# Altium schematic sheet Power_Supply.SchDoc
size A3; PageSetup: Record=PageOptions|CenterHorizontal=True|CenterVertical=True|PrintScale=0.73|XCorrection=1.00|YCorrection=1.00|PrintKind=0|BorderSize=5000000|LeftOffset=0|BottomOffset=0|Orientation=2|PaperLength=1000|PaperWidth=1000|Scale=100|PaperSource=7|PrintQuality=-4|MediaType=1|DitherType=10|PaperKind=A4|PrintScaleMode=1; Date: 27.05.2014; DrawnBy: luths8; Organization: BFH; Address1: Bern University of Applied Sciences; Address2: Engineering and Information Technology; Address3: Jlcoweg 1; Address4: CH-3400 Burgdorf; DocumentNumber: 3; Revision: 1.0; SheetNumber: 6; SheetTotal: 19; CurrentDate: 27.05.2014
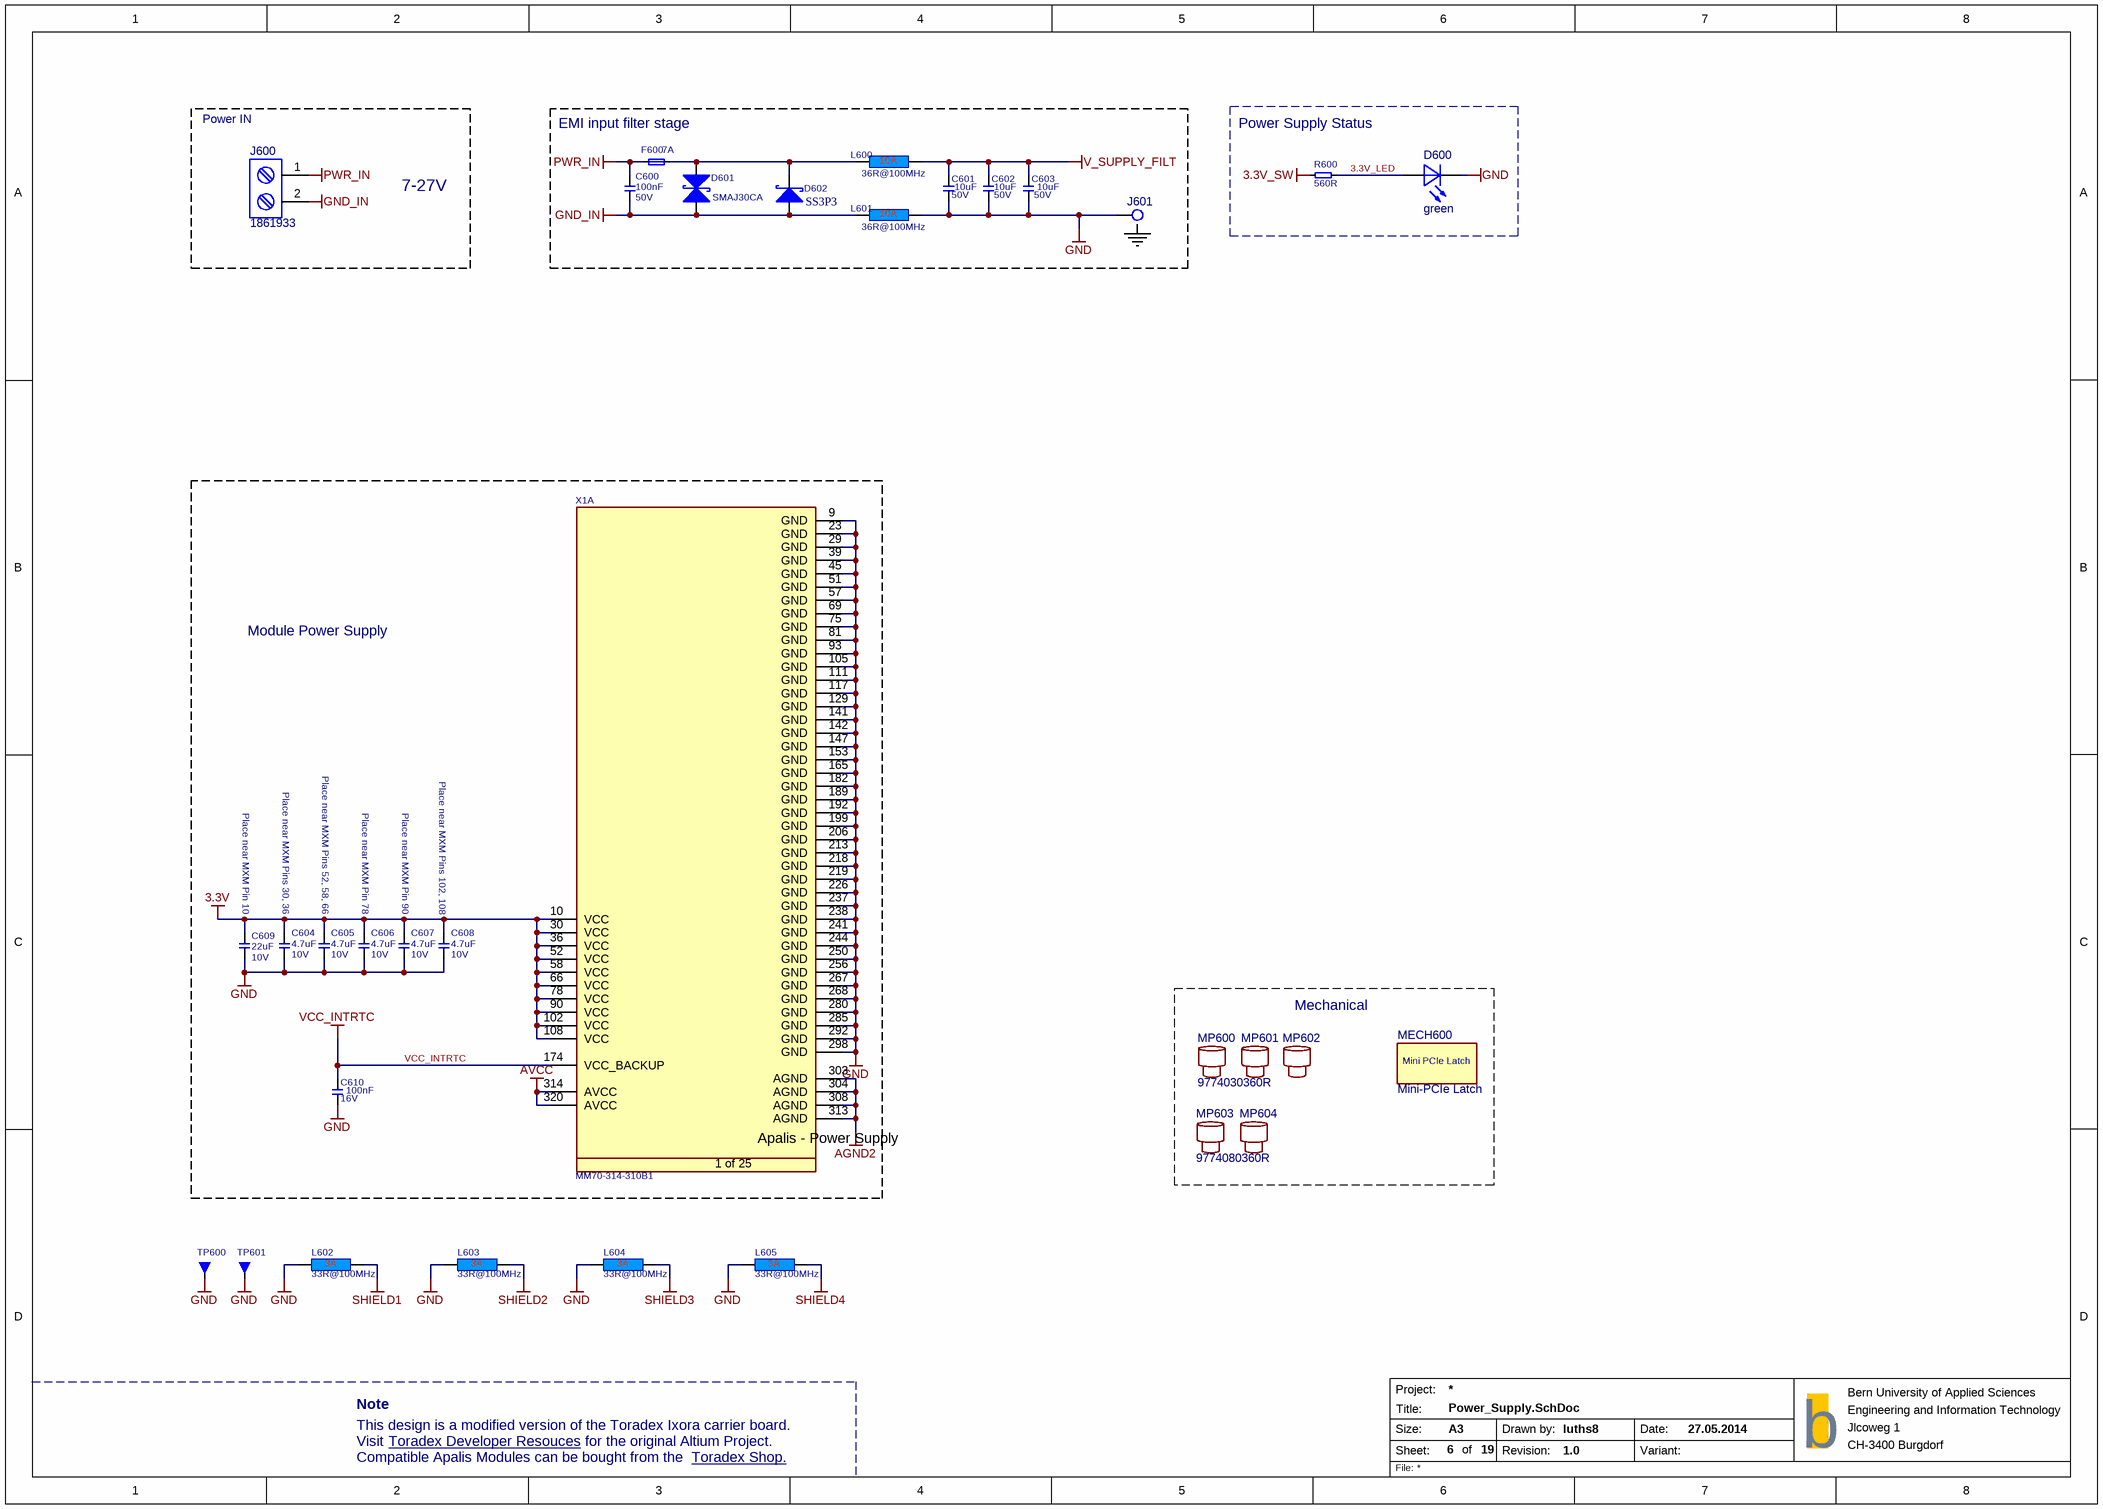
[diagram p0: Power_Supply.SchDoc]

## Parts
C600  Rating: 50V  [SMD0603CAP]  (hidden comment: 100nF)
C601  Rating: 50V  [SMD1210CAP]  (hidden comment: 10uF)
C602  Rating: 50V  [SMD1210CAP]  (hidden comment: 10uF)
C603  Rating: 50V  [SMD1210CAP]  (hidden comment: 10uF)
C604  Rating: 10V  [SMD0603CAP]  (hidden comment: 4.7uF)
C605  Rating: 10V  [SMD0603CAP]  (hidden comment: 4.7uF)
C606  Rating: 10V  [SMD0603CAP]  (hidden comment: 4.7uF)
C607  Rating: 10V  [SMD0603CAP]  (hidden comment: 4.7uF)
C608  Rating: 10V  [SMD0603CAP]  (hidden comment: 4.7uF)
C609  Rating: 10V  [SMD0805CAP]  (hidden comment: 22uF)
C610  Rating: 16V  [SMD0603CAP]  (hidden comment: 100nF)
D600  green  [LED]
D601  Manufacturer Part No.: SMAJ30CA  [T_LITTLEFUSE_SMAJ30CA]  (hidden comment: D-Littelfuse-SMAJ30CA-Schottky)
D602  SS3P3  [T_VISHAY_SS3P3]
F600  7A  [T_Littelfuse_0458]
J600  1861933  [1861933]
J601  Solder Pin  [SOLDER_PIN]  (value not drawn)  (net tie, no BOM)
L600  36R@100MHz  [T_Laird_35F0121-0SR-10]
L601  36R@100MHz  [T_Laird_35F0121-0SR-10]
L602  33R@100MHz  [INDC1608X95N]
L603  33R@100MHz  [INDC1608X95N]
L604  33R@100MHz  [INDC1608X95N]
L605  33R@100MHz  [INDC1608X95N]
MECH600  Mini-PCIe Latch  [T_Molex_48099-5701]
MP600  9774030360R
MP601  9774030360R  (value not drawn)
MP602  9774030360R  (value not drawn)
MP603  9774080360R
MP604  9774080360R  (value not drawn)
R600  560R  [SMD0603RES]
TP600  5011  [T_TP-THT - EYE]  (value not drawn)
TP601  5011  [T_TP-THT - EYE]  (value not drawn)
X1  Manufacturer Part No.: MM70-314-310B1  [T_JAE_MM70-314-310B1]  (hidden comment: CON-JAE-MM70-314-310B1-314-0.5mm)  (part A of 25)

## Blocks framed on the sheet
7-27V: J600
EMI input filter stage: C600-C603 D601 D602 F600 J601 L600 L601
Power Supply Status: D600 R600
Module Power Supply: C604-C610 X1
Mechanical: MECH600 MP600-MP604

## Nets
3.3V: C604.1 C605.1 C606.1 C607.1 C608.1 C609.1 X1.10(VCC) X1.30(VCC) X1.36(VCC) X1.52(VCC) X1.58(VCC) X1.66(VCC) X1.78(VCC) X1.90(VCC) X1.102(VCC) X1.108(VCC)
3.3V_SW: R600.1
AGND2: X1.303(AGND) X1.304(AGND) X1.308(AGND) X1.313(AGND)
AVCC: X1.314(AVCC) X1.320(AVCC)
GND: C601.1 C602.1 C603.1 C604.2 C605.2 C606.2 C607.2 C608.2 C609.2 C610.1 D600.C J601.1 L601.2 L602.1 L603.1 L604.1 L605.1 TP600.1 TP601.1 X1.9(GND) X1.23(GND) X1.29(GND) X1.39(GND) X1.45(GND) X1.51(GND) X1.57(GND) X1.69(GND) X1.75(GND) X1.81(GND) X1.93(GND) X1.105(GND) X1.111(GND) X1.117(GND) X1.129(GND) X1.141(GND) X1.142(GND) X1.147(GND) X1.153(GND) X1.165(GND) X1.182(GND) X1.189(GND) X1.192(GND) X1.199(GND) X1.206(GND) X1.213(GND) X1.218(GND) X1.219(GND) X1.226(GND) X1.237(GND) X1.238(GND) X1.241(GND) X1.244(GND) X1.250(GND) X1.256(GND) X1.267(GND) X1.268(GND) X1.280(GND) X1.285(GND) X1.292(GND) X1.298(GND)
GND_IN: C600.1 D601.2(Anode) D602.2 J600.2 L601.1
PWR_IN: C600.2 F600.1 J600.1
SHIELD1: L602.2
SHIELD2: L603.2
SHIELD3: L604.2
SHIELD4: L605.2
V_SUPPLY_FILT: C601.2 C602.2 C603.2 L600.2
VCC_INTRTC: C610.2 X1.174(VCC_BACKUP)
3.3V_LED: D600.A R600.2
NetD601_1: D601.1(Cathode) D602.1 F600.2 L600.1

## Notes on the sheet
- Power IN
- (near C604) Place near MXM Pins 30, 36
- (near C605) Place near MXM Pins 52, 58, 66
- Place near MXM Pins 102, 108
- Place near MXM Pin 10
- Place near MXM Pin 78
- Place near MXM Pin 90
- Note
- This design is a modified version of the Toradex Ixora carrier board.
- Visit
- Compatible Apalis Modules can be bought from the
- Toradex Developer Resouces <https://developer.toradex.com/products/ixora-carrier-board>
- for the original Altium Project.
- Toradex Shop. <https://www.toradex.com/order-now/apalis-arm-family>
- Project:
- Size:
- Sheet:
- Title:
- A3
- of
- Drawn by:
- Revision:
- Date:
- Variant:
- b
- File:
- (in symbol CON-JAE-MM70-314-310B1-314-0.5mm, part A) Apalis - Power Supply; 1 of 25
- (in symbol MECH-Molex-48099-5701) Mini PCIe Latch

## Library data of the parts
C600 = C-X7R-100nF-50V-20%-0603: Capacitor Ceramic X7R 100nF 50V 20% 0603; Tolerance: 20%; Type: X7R; Value: 100nF
C601-C603 = C-X5R-10uF-50V-20%-1210: Capacitor Ceramic X5R 10uF 50V 20% 1210; Tolerance: 20%; Type: X5R; Value: 10uF
C604-C608 = C-X5R-4.7uF-10V-10%-0603: Capacitor Ceramic X5R 4.7uF 10V 10% 0603; Tolerance: 10%; Type: X5R; Value: 4.7uF
C609 = C-X5R-22uF-10V-20%-0805: Capacitor Ceramic X5R 22uF 10V 20% 0805; Tolerance: 20%; Type: X5R; Value: 22uF
C610 = C-X7R-100nF-16V-10%-0402: Capacitor Ceramic X7R 100nF 16V 10% 0603; Tolerance: 10%; Type: X7R; Value: 100nF
D600 = LED green: Manufacturer Part No.: LGM67KG1J224Z
D601 = D-Littelfuse-SMAJ30CA-Schottky: Bidirectional ESD protection; Manufacturer Name: Littelfuse
D602 = D-Vishay-SS3P3-E3/84A-Schottky: SS3P3-E3/84A Schottky Diode; Manufacturer Name: Vishay; Manufacturer Part No.: SS3P3-E3/84A
F600 = F-Littelfuse-0458007: Fuse 7A Fast; Manufacturer Part No.: 0458007; Manufacturer Name: Littelfuse; Value: 7A
J600 = 1861933: Screw Terminal, 2 Position, 5mm Spacing; System: Connector
L600 L601 = L-Laird-35F0121-0SR-10-10A-25%: Power Supply FB 10A; Tolerance: 25%; Rating: 10A; Value: 36R@100MHz
L602-L605 = L-33R@100MHz-3A-25%-0603: 33R@100MHz 3A EMI FILTER; Tolerance: 25%; Rating: 3A; Value: 33R@100MHz
MECH600 = MECH-Molex-48099-5701: Manufacturer Name: Molex; Manufacturer Part No.: 48099-5701
MP600-MP604 = Spacer M3 SMD
  MP600-MP602: Manufacturer Part No.: 9774030360R
  MP603 MP604: Manufacturer Part No.: 9774080360R
R600 = R-560R-63mW-5%-0402: Resistor 560 ohm 63mW 5% 0603; Rating: 63mW; Tolerance: 5%; Value: 560R
TP600 TP601 = TP-Keystone-5011: Testpin Eye TH; Manufacturere Name: Keystone; Manufacturer Part No.: 5011
X1 = CON-JAE-MM70-314-310B1-314-0.5mm: MXM3 Connector; Manufacturer Name: JAE; No. of ways: 314